# Altium schematic sheet ESP32-WROOM-32D.SchDoc
size A4
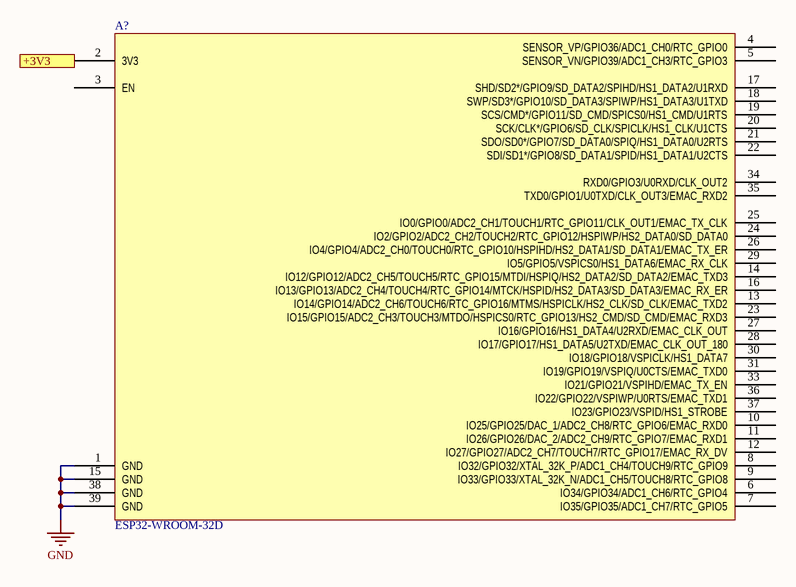
[diagram p0: ESP32-WROOM-32D.SchDoc]

## Parts
A?  ESP32-WROOM-32D  [Espressif ESP32-WROOM-32]

## Ports
+3V3

## Nets
GND: A?.1(GND) A?.15(GND) A?.38(GND) A?.39(GND)
+3V3: A?.2(3V3) ; port +3V3

Not connected (* = marked no-connect by the designer): A? 3(EN) 4(SENSOR_VP/GPIO36/ADC1_CH0/RTC_GPIO0) 5(SENSOR_VN/GPIO39/ADC1_CH3/RTC_GPIO3) 6(IO34/GPIO34/ADC1_CH6/RTC_GPIO4) 7(IO35/GPIO35/ADC1_CH7/RTC_GPIO5) 8(IO32/GPIO32/XTAL_32K_P/ADC1_CH4/TOUCH9/RTC_GPIO9) 9(IO33/GPIO33/XTAL_32K_N/ADC1_CH5/TOUCH8/RTC_GPIO8) 10(IO25/GPIO25/DAC_1/ADC2_CH8/RTC_GPIO6/EMAC_RXD0) 11(IO26/GPIO26/DAC_2/ADC2_CH9/RTC_GPIO7/EMAC_RXD1) 12(IO27/GPIO27/ADC2_CH7/TOUCH7/RTC_GPIO17/EMAC_RX_DV) 13(IO14/GPIO14/ADC2_CH6/TOUCH6/RTC_GPIO16/MTMS/HSPICLK/HS2_CLK/SD_CLK/EMAC_TXD2) 14(IO12/GPIO12/ADC2_CH5/TOUCH5/RTC_GPIO15/MTDI/HSPIQ/HS2_DATA2/SD_DATA2/EMAC_TXD3) 16(IO13/GPIO13/ADC2_CH4/TOUCH4/RTC_GPIO14/MTCK/HSPID/HS2_DATA3/SD_DATA3/EMAC_RX_ER) 17(SHD/SD2*/GPIO9/SD_DATA2/SPIHD/HS1_DATA2/U1RXD) 18(SWP/SD3*/GPIO10/SD_DATA3/SPIWP/HS1_DATA3/U1TXD) 19(SCS/CMD*/GPIO11/SD_CMD/SPICS0/HS1_CMD/U1RTS) 20(SCK/CLK*/GPIO6/SD_CLK/SPICLK/HS1_CLK/U1CTS) 21(SDO/SD0*/GPIO7/SD_DATA0/SPIQ/HS1_DATA0/U2RTS) 22(SDI/SD1*/GPIO8/SD_DATA1/SPID/HS1_DATA1/U2CTS) 23(IO15/GPIO15/ADC2_CH3/TOUCH3/MTDO/HSPICS0/RTC_GPIO13/HS2_CMD/SD_CMD/EMAC_RXD3) 24(IO2/GPIO2/ADC2_CH2/TOUCH2/RTC_GPIO12/HSPIWP/HS2_DATA0/SD_DATA0) 25(IO0/GPIO0/ADC2_CH1/TOUCH1/RTC_GPIO11/CLK_OUT1/EMAC_TX_CLK) 26(IO4/GPIO4/ADC2_CH0/TOUCH0/RTC_GPIO10/HSPIHD/HS2_DATA1/SD_DATA1/EMAC_TX_ER) 27(IO16/GPIO16/HS1_DATA4/U2RXD/EMAC_CLK_OUT) 28(IO17/GPIO17/HS1_DATA5/U2TXD/EMAC_CLK_OUT_180) 29(IO5/GPIO5/VSPICS0/HS1_DATA6/EMAC_RX_CLK) 30(IO18/GPIO18/VSPICLK/HS1_DATA7) 31(IO19/GPIO19/VSPIQ/U0CTS/EMAC_TXD0) 33(IO21/GPIO21/VSPIHD/EMAC_TX_EN) 34(RXD0/GPIO3/U0RXD/CLK_OUT2) 35(TXD0/GPIO1/U0TXD/CLK_OUT3/EMAC_RXD2) 36(IO22/GPIO22/VSPIWP/U0RTS/EMAC_TXD1) 37(IO23/GPIO23/VSPID/HS1_STROBE)

## Library data of the parts
A? = ESP32-WROOM-32D: WIFI MODULE 32MBITS SPI FLASH; Manufacturer: Espressif Systems; Utilized IC / Part: ESP32-D0WD; Antenna Type: Integrated, Trace; Data Rate: 150Mbps; Frequency: 2.4GHz ~ 2.5GHz; Memory Size: 448kB ROM, 536kB SRAM; Modulation: CCK, DSSS, OFDM; Power - Output: 20.5dBm; Protocol: 802.11b/g/n, Bluetooth v4.2 + EDR, Class 1, 2 and 3; RF Family/Standard: Bluetooth, WiFi; Sensitivity: -98dBm; Serial Interfaces: GPIO, I²C, I²S, PWM, SDIO, SPI, UART; Voltage - Supply: 2.7V ~ 3.6V; Part Number: ESP32-WROOM-32D; ComponentLink1Description: Datasheet; ComponentLink1URL: https://www.espressif.com/sites/default/files/documentation/esp32-wroom-32d_esp32-wroom-32u_datasheet_en.pdf; ComponentLink2Description: DigiKey Link; ComponentLink2URL: http://digikey.com/product-detail/en/espressif-systems/ESP32-WROOM-32D/1904-1023-1-ND/9381732; LastUpdated: 31.7.2020 15:42:37; Lifecycle Status: Active; Minimum Order: 1; Mounting Type: Surface Mount; Operating Temperature: -40°C ~ 85°C; Package / Case: 38-SMD Module; Packaging: TapeAndReel; Part Status: Active; Price: 3.80; Series: ESP32; Supplier 1: DigiKey; Supplier Part Number 1: 1904-1023-1-ND